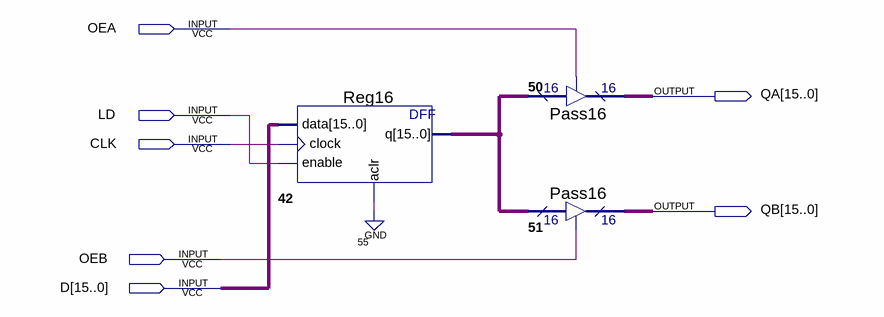
[diagram p0: schematic sheet]
// Quartus schematic register16.bdf as structural Verilog: 3 symbols, 7 pins
module register16 (
  input  OEA,
  input  LD,
  input  CLK,
  input  OEB,
  input  [15:0] D,
  output [15:0] QA,
  output [15:0] QB
);

  wire [15:0] n42_q;

  Reg16 u_42 (.data(D), .clock(CLK), .enable(LD), .aclr(1'b0), .q(n42_q));
  Pass16 u_50 (.enabledt(OEA), .data(n42_q), .tridata(QA));
  Pass16 u_51 (.enabledt(OEB), .data(n42_q), .tridata(QB));
endmodule
